# EAGLE design wordclock_frame_led_pcb (EAGLE 9.6.2)
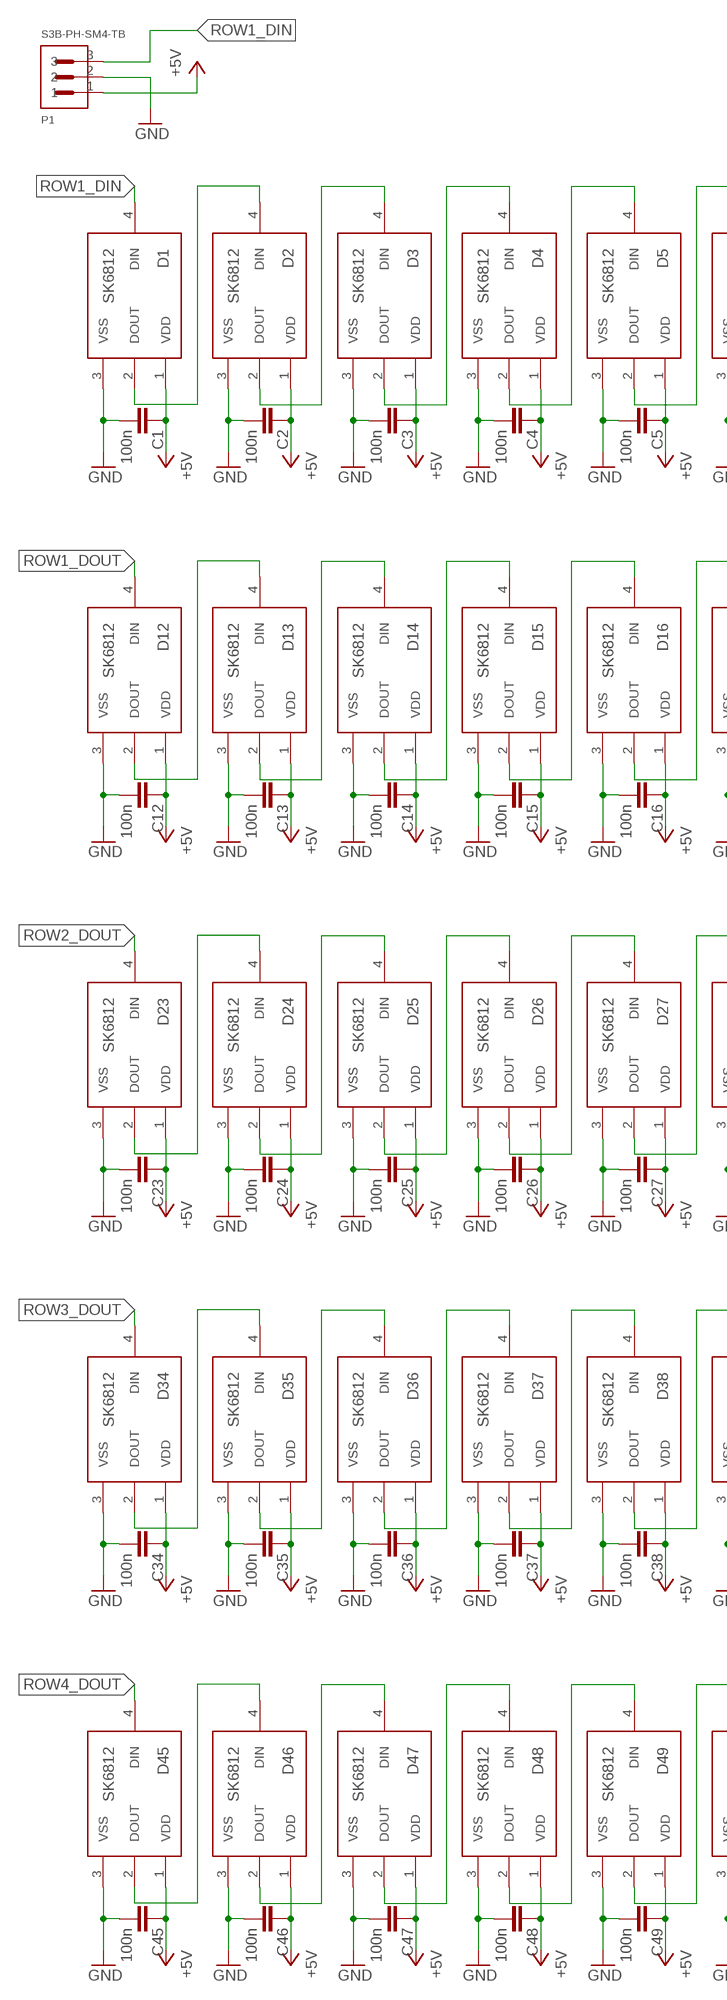
[diagram p0: schematic, sheet 1, part 1 of 2]
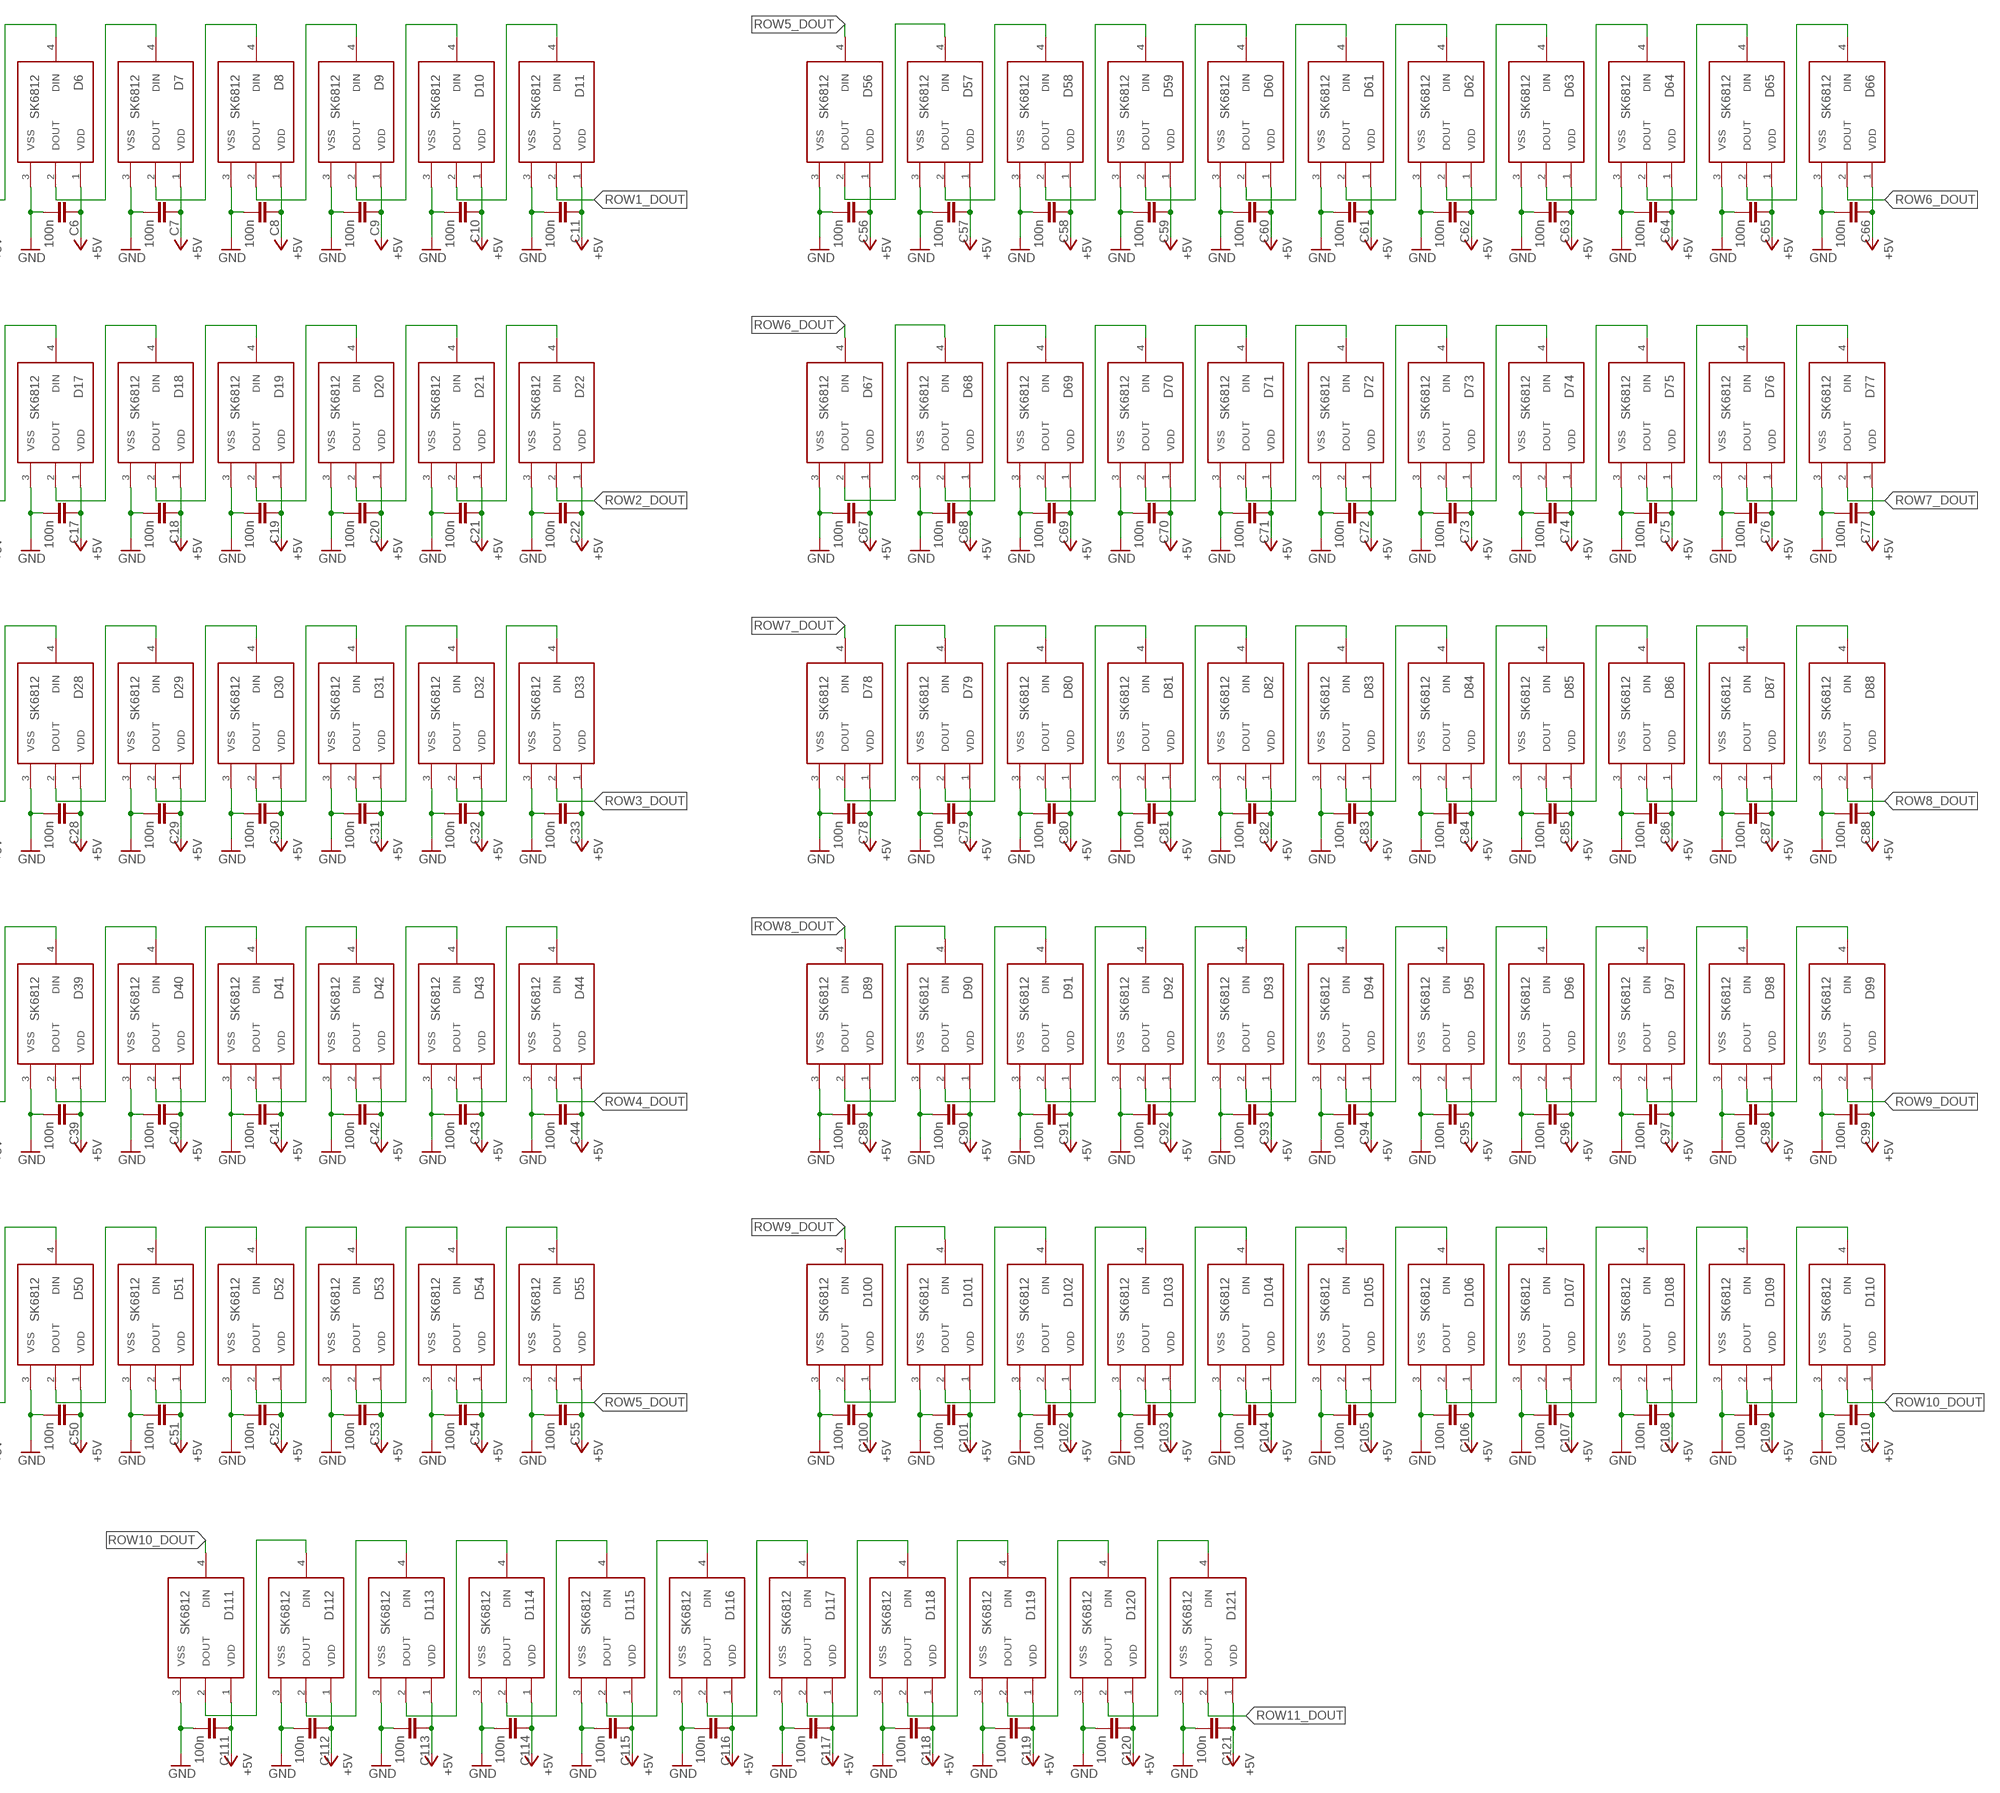
[diagram p1: schematic, sheet 1, part 2 of 2]

## Parts
C1  100n  C-EUC0603  [C0603]
C2  100n  C-EUC0603  [C0603]
C3  100n  C-EUC0603  [C0603]
C4  100n  C-EUC0603  [C0603]
C5  100n  C-EUC0603  [C0603]
C6  100n  C-EUC0603  [C0603]
C7  100n  C-EUC0603  [C0603]
C8  100n  C-EUC0603  [C0603]
C9  100n  C-EUC0603  [C0603]
C10  100n  C-EUC0603  [C0603]
C11  100n  C-EUC0603  [C0603]
C12  100n  C-EUC0603  [C0603]
C13  100n  C-EUC0603  [C0603]
C14  100n  C-EUC0603  [C0603]
C15  100n  C-EUC0603  [C0603]
C16  100n  C-EUC0603  [C0603]
C17  100n  C-EUC0603  [C0603]
C18  100n  C-EUC0603  [C0603]
C19  100n  C-EUC0603  [C0603]
C20  100n  C-EUC0603  [C0603]
C21  100n  C-EUC0603  [C0603]
C22  100n  C-EUC0603  [C0603]
C23  100n  C-EUC0603  [C0603]
C24  100n  C-EUC0603  [C0603]
C25  100n  C-EUC0603  [C0603]
C26  100n  C-EUC0603  [C0603]
C27  100n  C-EUC0603  [C0603]
C28  100n  C-EUC0603  [C0603]
C29  100n  C-EUC0603  [C0603]
C30  100n  C-EUC0603  [C0603]
C31  100n  C-EUC0603  [C0603]
C32  100n  C-EUC0603  [C0603]
C33  100n  C-EUC0603  [C0603]
C34  100n  C-EUC0603  [C0603]
C35  100n  C-EUC0603  [C0603]
C36  100n  C-EUC0603  [C0603]
C37  100n  C-EUC0603  [C0603]
C38  100n  C-EUC0603  [C0603]
C39  100n  C-EUC0603  [C0603]
C40  100n  C-EUC0603  [C0603]
C41  100n  C-EUC0603  [C0603]
C42  100n  C-EUC0603  [C0603]
C43  100n  C-EUC0603  [C0603]
C44  100n  C-EUC0603  [C0603]
C45  100n  C-EUC0603  [C0603]
C46  100n  C-EUC0603  [C0603]
C47  100n  C-EUC0603  [C0603]
C48  100n  C-EUC0603  [C0603]
C49  100n  C-EUC0603  [C0603]
C50  100n  C-EUC0603  [C0603]
C51  100n  C-EUC0603  [C0603]
C52  100n  C-EUC0603  [C0603]
C53  100n  C-EUC0603  [C0603]
C54  100n  C-EUC0603  [C0603]
C55  100n  C-EUC0603  [C0603]
C56  100n  C-EUC0603  [C0603]
C57  100n  C-EUC0603  [C0603]
C58  100n  C-EUC0603  [C0603]
C59  100n  C-EUC0603  [C0603]
C60  100n  C-EUC0603  [C0603]
C61  100n  C-EUC0603  [C0603]
C62  100n  C-EUC0603  [C0603]
C63  100n  C-EUC0603  [C0603]
C64  100n  C-EUC0603  [C0603]
C65  100n  C-EUC0603  [C0603]
C66  100n  C-EUC0603  [C0603]
C67  100n  C-EUC0603  [C0603]
C68  100n  C-EUC0603  [C0603]
C69  100n  C-EUC0603  [C0603]
C70  100n  C-EUC0603  [C0603]
C71  100n  C-EUC0603  [C0603]
C72  100n  C-EUC0603  [C0603]
C73  100n  C-EUC0603  [C0603]
C74  100n  C-EUC0603  [C0603]
C75  100n  C-EUC0603  [C0603]
C76  100n  C-EUC0603  [C0603]
C77  100n  C-EUC0603  [C0603]
C78  100n  C-EUC0603  [C0603]
C79  100n  C-EUC0603  [C0603]
C80  100n  C-EUC0603  [C0603]
C81  100n  C-EUC0603  [C0603]
C82  100n  C-EUC0603  [C0603]
C83  100n  C-EUC0603  [C0603]
C84  100n  C-EUC0603  [C0603]
C85  100n  C-EUC0603  [C0603]
C86  100n  C-EUC0603  [C0603]
C87  100n  C-EUC0603  [C0603]
C88  100n  C-EUC0603  [C0603]
C89  100n  C-EUC0603  [C0603]
C90  100n  C-EUC0603  [C0603]
C91  100n  C-EUC0603  [C0603]
C92  100n  C-EUC0603  [C0603]
C93  100n  C-EUC0603  [C0603]
C94  100n  C-EUC0603  [C0603]
C95  100n  C-EUC0603  [C0603]
C96  100n  C-EUC0603  [C0603]
C97  100n  C-EUC0603  [C0603]
C98  100n  C-EUC0603  [C0603]
C99  100n  C-EUC0603  [C0603]
C100  100n  C-EUC0603  [C0603]
C101  100n  C-EUC0603  [C0603]
C102  100n  C-EUC0603  [C0603]
C103  100n  C-EUC0603  [C0603]
C104  100n  C-EUC0603  [C0603]
C105  100n  C-EUC0603  [C0603]
C106  100n  C-EUC0603  [C0603]
C107  100n  C-EUC0603  [C0603]
C108  100n  C-EUC0603  [C0603]
C109  100n  C-EUC0603  [C0603]
C110  100n  C-EUC0603  [C0603]
C111  100n  C-EUC0603  [C0603]
C112  100n  C-EUC0603  [C0603]
C113  100n  C-EUC0603  [C0603]
C114  100n  C-EUC0603  [C0603]
C115  100n  C-EUC0603  [C0603]
C116  100n  C-EUC0603  [C0603]
C117  100n  C-EUC0603  [C0603]
C118  100n  C-EUC0603  [C0603]
C119  100n  C-EUC0603  [C0603]
C120  100n  C-EUC0603  [C0603]
C121  100n  C-EUC0603  [C0603]
D1  SK6812  [LED_SK6812]
D2  SK6812  [LED_SK6812]
D3  SK6812  [LED_SK6812]
D4  SK6812  [LED_SK6812]
D5  SK6812  [LED_SK6812]
D6  SK6812  [LED_SK6812]
D7  SK6812  [LED_SK6812]
D8  SK6812  [LED_SK6812]
D9  SK6812  [LED_SK6812]
D10  SK6812  [LED_SK6812]
D11  SK6812  [LED_SK6812]
D12  SK6812  [LED_SK6812]
D13  SK6812  [LED_SK6812]
D14  SK6812  [LED_SK6812]
D15  SK6812  [LED_SK6812]
D16  SK6812  [LED_SK6812]
D17  SK6812  [LED_SK6812]
D18  SK6812  [LED_SK6812]
D19  SK6812  [LED_SK6812]
D20  SK6812  [LED_SK6812]
D21  SK6812  [LED_SK6812]
D22  SK6812  [LED_SK6812]
D23  SK6812  [LED_SK6812]
D24  SK6812  [LED_SK6812]
D25  SK6812  [LED_SK6812]
D26  SK6812  [LED_SK6812]
D27  SK6812  [LED_SK6812]
D28  SK6812  [LED_SK6812]
D29  SK6812  [LED_SK6812]
D30  SK6812  [LED_SK6812]
D31  SK6812  [LED_SK6812]
D32  SK6812  [LED_SK6812]
D33  SK6812  [LED_SK6812]
D34  SK6812  [LED_SK6812]
D35  SK6812  [LED_SK6812]
D36  SK6812  [LED_SK6812]
D37  SK6812  [LED_SK6812]
D38  SK6812  [LED_SK6812]
D39  SK6812  [LED_SK6812]
D40  SK6812  [LED_SK6812]
D41  SK6812  [LED_SK6812]
D42  SK6812  [LED_SK6812]
D43  SK6812  [LED_SK6812]
D44  SK6812  [LED_SK6812]
D45  SK6812  [LED_SK6812]
D46  SK6812  [LED_SK6812]
D47  SK6812  [LED_SK6812]
D48  SK6812  [LED_SK6812]
D49  SK6812  [LED_SK6812]
D50  SK6812  [LED_SK6812]
D51  SK6812  [LED_SK6812]
D52  SK6812  [LED_SK6812]
D53  SK6812  [LED_SK6812]
D54  SK6812  [LED_SK6812]
D55  SK6812  [LED_SK6812]
D56  SK6812  [LED_SK6812]
D57  SK6812  [LED_SK6812]
D58  SK6812  [LED_SK6812]
D59  SK6812  [LED_SK6812]
D60  SK6812  [LED_SK6812]
D61  SK6812  [LED_SK6812]
D62  SK6812  [LED_SK6812]
D63  SK6812  [LED_SK6812]
D64  SK6812  [LED_SK6812]
D65  SK6812  [LED_SK6812]
D66  SK6812  [LED_SK6812]
D67  SK6812  [LED_SK6812]
D68  SK6812  [LED_SK6812]
D69  SK6812  [LED_SK6812]
D70  SK6812  [LED_SK6812]
D71  SK6812  [LED_SK6812]
D72  SK6812  [LED_SK6812]
D73  SK6812  [LED_SK6812]
D74  SK6812  [LED_SK6812]
D75  SK6812  [LED_SK6812]
D76  SK6812  [LED_SK6812]
D77  SK6812  [LED_SK6812]
D78  SK6812  [LED_SK6812]
D79  SK6812  [LED_SK6812]
D80  SK6812  [LED_SK6812]
D81  SK6812  [LED_SK6812]
D82  SK6812  [LED_SK6812]
D83  SK6812  [LED_SK6812]
D84  SK6812  [LED_SK6812]
D85  SK6812  [LED_SK6812]
D86  SK6812  [LED_SK6812]
D87  SK6812  [LED_SK6812]
D88  SK6812  [LED_SK6812]
D89  SK6812  [LED_SK6812]
D90  SK6812  [LED_SK6812]
D91  SK6812  [LED_SK6812]
D92  SK6812  [LED_SK6812]
D93  SK6812  [LED_SK6812]
D94  SK6812  [LED_SK6812]
D95  SK6812  [LED_SK6812]
D96  SK6812  [LED_SK6812]
D97  SK6812  [LED_SK6812]
D98  SK6812  [LED_SK6812]
D99  SK6812  [LED_SK6812]
D100  SK6812  [LED_SK6812]
D101  SK6812  [LED_SK6812]
D102  SK6812  [LED_SK6812]
D103  SK6812  [LED_SK6812]
D104  SK6812  [LED_SK6812]
D105  SK6812  [LED_SK6812]
D106  SK6812  [LED_SK6812]
D107  SK6812  [LED_SK6812]
D108  SK6812  [LED_SK6812]
D109  SK6812  [LED_SK6812]
D110  SK6812  [LED_SK6812]
D111  SK6812  [LED_SK6812]
D112  SK6812  [LED_SK6812]
D113  SK6812  [LED_SK6812]
D114  SK6812  [LED_SK6812]
D115  SK6812  [LED_SK6812]
D116  SK6812  [LED_SK6812]
D117  SK6812  [LED_SK6812]
D118  SK6812  [LED_SK6812]
D119  SK6812  [LED_SK6812]
D120  SK6812  [LED_SK6812]
D121  SK6812  [LED_SK6812]
P1  S3B-PH-SM4-TB  [JST_S3B-PH-SM4-TB]

## Nets
GND: C1.2 C2.2 C3.2 C4.2 C5.2 C6.2 C7.2 C8.2 C9.2 C10.2 C11.2 C12.2 C13.2 C14.2 C15.2 C16.2 C17.2 C18.2 C19.2 C20.2 C21.2 C22.2 C23.2 C24.2 C25.2 C26.2 C27.2 C28.2 C29.2 C30.2 C31.2 C32.2 C33.2 C34.2 C35.2 C36.2 C37.2 C38.2 C39.2 C40.2 C41.2 C42.2 C43.2 C44.2 C45.2 C46.2 C47.2 C48.2 C49.2 C50.2 C51.2 C52.2 C53.2 C54.2 C55.2 C56.2 C57.2 C58.2 C59.2 C60.2 C61.2 C62.2 C63.2 C64.2 C65.2 C66.2 C67.2 C68.2 C69.2 C70.2 C71.2 C72.2 C73.2 C74.2 C75.2 C76.2 C77.2 C78.2 C79.2 C80.2 C81.2 C82.2 C83.2 C84.2 C85.2 C86.2 C87.2 C88.2 C89.2 C90.2 C91.2 C92.2 C93.2 C94.2 C95.2 C96.2 C97.2 C98.2 C99.2 C100.2 C101.2 C102.2 C103.2 C104.2 C105.2 C106.2 C107.2 C108.2 C109.2 C110.2 C111.2 C112.2 C113.2 C114.2 C115.2 C116.2 C117.2 C118.2 C119.2 C120.2 C121.2 D1.3(VSS) D2.3(VSS) D3.3(VSS) D4.3(VSS) D5.3(VSS) D6.3(VSS) D7.3(VSS) D8.3(VSS) D9.3(VSS) D10.3(VSS) D11.3(VSS) D12.3(VSS) D13.3(VSS) D14.3(VSS) D15.3(VSS) D16.3(VSS) D17.3(VSS) D18.3(VSS) D19.3(VSS) D20.3(VSS) D21.3(VSS) D22.3(VSS) D23.3(VSS) D24.3(VSS) D25.3(VSS) D26.3(VSS) D27.3(VSS) D28.3(VSS) D29.3(VSS) D30.3(VSS) D31.3(VSS) D32.3(VSS) D33.3(VSS) D34.3(VSS) D35.3(VSS) D36.3(VSS) D37.3(VSS) D38.3(VSS) D39.3(VSS) D40.3(VSS) D41.3(VSS) D42.3(VSS) D43.3(VSS) D44.3(VSS) D45.3(VSS) D46.3(VSS) D47.3(VSS) D48.3(VSS) D49.3(VSS) D50.3(VSS) D51.3(VSS) D52.3(VSS) D53.3(VSS) D54.3(VSS) D55.3(VSS) D56.3(VSS) D57.3(VSS) D58.3(VSS) D59.3(VSS) D60.3(VSS) D61.3(VSS) D62.3(VSS) D63.3(VSS) D64.3(VSS) D65.3(VSS) D66.3(VSS) D67.3(VSS) D68.3(VSS) D69.3(VSS) D70.3(VSS) D71.3(VSS) D72.3(VSS) D73.3(VSS) D74.3(VSS) D75.3(VSS) D76.3(VSS) D77.3(VSS) D78.3(VSS) D79.3(VSS) D80.3(VSS) D81.3(VSS) D82.3(VSS) D83.3(VSS) D84.3(VSS) D85.3(VSS) D86.3(VSS) D87.3(VSS) D88.3(VSS) D89.3(VSS) D90.3(VSS) D91.3(VSS) D92.3(VSS) D93.3(VSS) D94.3(VSS) D95.3(VSS) D96.3(VSS) D97.3(VSS) D98.3(VSS) D99.3(VSS) D100.3(VSS) D101.3(VSS) D102.3(VSS) D103.3(VSS) D104.3(VSS) D105.3(VSS) D106.3(VSS) D107.3(VSS) D108.3(VSS) D109.3(VSS) D110.3(VSS) D111.3(VSS) D112.3(VSS) D113.3(VSS) D114.3(VSS) D115.3(VSS) D116.3(VSS) D117.3(VSS) D118.3(VSS) D119.3(VSS) D120.3(VSS) D121.3(VSS) P1.2
N$1: D1.2(DOUT) D2.4(DIN)
N$2: D2.2(DOUT) D3.4(DIN)
N$3: D3.2(DOUT) D4.4(DIN)
N$4: D4.2(DOUT) D5.4(DIN)
N$5: D5.2(DOUT) D6.4(DIN)
N$6: D6.2(DOUT) D7.4(DIN)
N$7: D7.2(DOUT) D8.4(DIN)
N$8: D8.2(DOUT) D9.4(DIN)
N$9: D9.2(DOUT) D10.4(DIN)
N$10: D10.2(DOUT) D11.4(DIN)
N$11: D12.2(DOUT) D13.4(DIN)
N$12: D13.2(DOUT) D14.4(DIN)
N$13: D14.2(DOUT) D15.4(DIN)
N$14: D15.2(DOUT) D16.4(DIN)
N$15: D16.2(DOUT) D17.4(DIN)
N$16: D17.2(DOUT) D18.4(DIN)
N$17: D18.2(DOUT) D19.4(DIN)
N$18: D19.2(DOUT) D20.4(DIN)
N$19: D20.2(DOUT) D21.4(DIN)
N$20: D21.2(DOUT) D22.4(DIN)
N$21: D23.2(DOUT) D24.4(DIN)
N$22: D24.2(DOUT) D25.4(DIN)
N$23: D25.2(DOUT) D26.4(DIN)
N$24: D26.2(DOUT) D27.4(DIN)
N$25: D27.2(DOUT) D28.4(DIN)
N$26: D28.2(DOUT) D29.4(DIN)
N$27: D29.2(DOUT) D30.4(DIN)
N$28: D30.2(DOUT) D31.4(DIN)
N$29: D31.2(DOUT) D32.4(DIN)
N$30: D32.2(DOUT) D33.4(DIN)
N$31: D34.2(DOUT) D35.4(DIN)
N$32: D35.2(DOUT) D36.4(DIN)
N$33: D36.2(DOUT) D37.4(DIN)
N$34: D37.2(DOUT) D38.4(DIN)
N$35: D38.2(DOUT) D39.4(DIN)
N$36: D39.2(DOUT) D40.4(DIN)
N$37: D40.2(DOUT) D41.4(DIN)
N$38: D41.2(DOUT) D42.4(DIN)
N$39: D42.2(DOUT) D43.4(DIN)
N$40: D43.2(DOUT) D44.4(DIN)
N$41: D45.2(DOUT) D46.4(DIN)
N$42: D46.2(DOUT) D47.4(DIN)
N$43: D47.2(DOUT) D48.4(DIN)
N$44: D48.2(DOUT) D49.4(DIN)
N$45: D49.2(DOUT) D50.4(DIN)
N$46: D50.2(DOUT) D51.4(DIN)
N$47: D51.2(DOUT) D52.4(DIN)
N$48: D52.2(DOUT) D53.4(DIN)
N$49: D53.2(DOUT) D54.4(DIN)
N$50: D54.2(DOUT) D55.4(DIN)
N$51: D56.2(DOUT) D57.4(DIN)
N$52: D57.2(DOUT) D58.4(DIN)
N$53: D58.2(DOUT) D59.4(DIN)
N$54: D59.2(DOUT) D60.4(DIN)
N$55: D60.2(DOUT) D61.4(DIN)
N$56: D61.2(DOUT) D62.4(DIN)
N$57: D62.2(DOUT) D63.4(DIN)
N$58: D63.2(DOUT) D64.4(DIN)
N$59: D64.2(DOUT) D65.4(DIN)
N$60: D65.2(DOUT) D66.4(DIN)
N$61: D67.2(DOUT) D68.4(DIN)
N$62: D68.2(DOUT) D69.4(DIN)
N$63: D69.2(DOUT) D70.4(DIN)
N$64: D70.2(DOUT) D71.4(DIN)
N$65: D71.2(DOUT) D72.4(DIN)
N$66: D72.2(DOUT) D73.4(DIN)
N$67: D73.2(DOUT) D74.4(DIN)
N$68: D74.2(DOUT) D75.4(DIN)
N$69: D75.2(DOUT) D76.4(DIN)
N$70: D76.2(DOUT) D77.4(DIN)
N$71: D78.2(DOUT) D79.4(DIN)
N$72: D79.2(DOUT) D80.4(DIN)
N$73: D80.2(DOUT) D81.4(DIN)
N$74: D81.2(DOUT) D82.4(DIN)
N$75: D82.2(DOUT) D83.4(DIN)
N$76: D83.2(DOUT) D84.4(DIN)
N$77: D84.2(DOUT) D85.4(DIN)
N$78: D85.2(DOUT) D86.4(DIN)
N$79: D86.2(DOUT) D87.4(DIN)
N$80: D87.2(DOUT) D88.4(DIN)
N$81: D89.2(DOUT) D90.4(DIN)
N$82: D90.2(DOUT) D91.4(DIN)
N$83: D91.2(DOUT) D92.4(DIN)
N$84: D92.2(DOUT) D93.4(DIN)
N$85: D93.2(DOUT) D94.4(DIN)
N$86: D94.2(DOUT) D95.4(DIN)
N$87: D95.2(DOUT) D96.4(DIN)
N$88: D96.2(DOUT) D97.4(DIN)
N$89: D97.2(DOUT) D98.4(DIN)
N$90: D98.2(DOUT) D99.4(DIN)
N$91: D100.2(DOUT) D101.4(DIN)
N$92: D101.2(DOUT) D102.4(DIN)
N$93: D102.2(DOUT) D103.4(DIN)
N$94: D103.2(DOUT) D104.4(DIN)
N$95: D104.2(DOUT) D105.4(DIN)
N$96: D105.2(DOUT) D106.4(DIN)
N$97: D106.2(DOUT) D107.4(DIN)
N$98: D107.2(DOUT) D108.4(DIN)
N$99: D108.2(DOUT) D109.4(DIN)
N$100: D109.2(DOUT) D110.4(DIN)
N$101: D111.2(DOUT) D112.4(DIN)
N$102: D112.2(DOUT) D113.4(DIN)
N$103: D113.2(DOUT) D114.4(DIN)
N$104: D114.2(DOUT) D115.4(DIN)
N$105: D115.2(DOUT) D116.4(DIN)
N$106: D116.2(DOUT) D117.4(DIN)
N$107: D117.2(DOUT) D118.4(DIN)
N$108: D118.2(DOUT) D119.4(DIN)
N$109: D119.2(DOUT) D120.4(DIN)
N$110: D120.2(DOUT) D121.4(DIN)
ROW1_DIN: D1.4(DIN) P1.3
ROW1_DOUT: D11.2(DOUT) D12.4(DIN)
ROW2_DOUT: D22.2(DOUT) D23.4(DIN)
ROW3_DOUT: D33.2(DOUT) D34.4(DIN)
ROW4_DOUT: D44.2(DOUT) D45.4(DIN)
ROW5_DOUT: D55.2(DOUT) D56.4(DIN)
ROW6_DOUT: D66.2(DOUT) D67.4(DIN)
ROW7_DOUT: D77.2(DOUT) D78.4(DIN)
ROW8_DOUT: D88.2(DOUT) D89.4(DIN)
ROW9_DOUT: D99.2(DOUT) D100.4(DIN)
ROW10_DOUT: D110.2(DOUT) D111.4(DIN)
ROW11_DOUT: D121.2(DOUT)
VCC: C1.1 C2.1 C3.1 C4.1 C5.1 C6.1 C7.1 C8.1 C9.1 C10.1 C11.1 C12.1 C13.1 C14.1 C15.1 C16.1 C17.1 C18.1 C19.1 C20.1 C21.1 C22.1 C23.1 C24.1 C25.1 C26.1 C27.1 C28.1 C29.1 C30.1 C31.1 C32.1 C33.1 C34.1 C35.1 C36.1 C37.1 C38.1 C39.1 C40.1 C41.1 C42.1 C43.1 C44.1 C45.1 C46.1 C47.1 C48.1 C49.1 C50.1 C51.1 C52.1 C53.1 C54.1 C55.1 C56.1 C57.1 C58.1 C59.1 C60.1 C61.1 C62.1 C63.1 C64.1 C65.1 C66.1 C67.1 C68.1 C69.1 C70.1 C71.1 C72.1 C73.1 C74.1 C75.1 C76.1 C77.1 C78.1 C79.1 C80.1 C81.1 C82.1 C83.1 C84.1 C85.1 C86.1 C87.1 C88.1 C89.1 C90.1 C91.1 C92.1 C93.1 C94.1 C95.1 C96.1 C97.1 C98.1 C99.1 C100.1 C101.1 C102.1 C103.1 C104.1 C105.1 C106.1 C107.1 C108.1 C109.1 C110.1 C111.1 C112.1 C113.1 C114.1 C115.1 C116.1 C117.1 C118.1 C119.1 C120.1 C121.1 D1.1(VDD) D2.1(VDD) D3.1(VDD) D4.1(VDD) D5.1(VDD) D6.1(VDD) D7.1(VDD) D8.1(VDD) D9.1(VDD) D10.1(VDD) D11.1(VDD) D12.1(VDD) D13.1(VDD) D14.1(VDD) D15.1(VDD) D16.1(VDD) D17.1(VDD) D18.1(VDD) D19.1(VDD) D20.1(VDD) D21.1(VDD) D22.1(VDD) D23.1(VDD) D24.1(VDD) D25.1(VDD) D26.1(VDD) D27.1(VDD) D28.1(VDD) D29.1(VDD) D30.1(VDD) D31.1(VDD) D32.1(VDD) D33.1(VDD) D34.1(VDD) D35.1(VDD) D36.1(VDD) D37.1(VDD) D38.1(VDD) D39.1(VDD) D40.1(VDD) D41.1(VDD) D42.1(VDD) D43.1(VDD) D44.1(VDD) D45.1(VDD) D46.1(VDD) D47.1(VDD) D48.1(VDD) D49.1(VDD) D50.1(VDD) D51.1(VDD) D52.1(VDD) D53.1(VDD) D54.1(VDD) D55.1(VDD) D56.1(VDD) D57.1(VDD) D58.1(VDD) D59.1(VDD) D60.1(VDD) D61.1(VDD) D62.1(VDD) D63.1(VDD) D64.1(VDD) D65.1(VDD) D66.1(VDD) D67.1(VDD) D68.1(VDD) D69.1(VDD) D70.1(VDD) D71.1(VDD) D72.1(VDD) D73.1(VDD) D74.1(VDD) D75.1(VDD) D76.1(VDD) D77.1(VDD) D78.1(VDD) D79.1(VDD) D80.1(VDD) D81.1(VDD) D82.1(VDD) D83.1(VDD) D84.1(VDD) D85.1(VDD) D86.1(VDD) D87.1(VDD) D88.1(VDD) D89.1(VDD) D90.1(VDD) D91.1(VDD) D92.1(VDD) D93.1(VDD) D94.1(VDD) D95.1(VDD) D96.1(VDD) D97.1(VDD) D98.1(VDD) D99.1(VDD) D100.1(VDD) D101.1(VDD) D102.1(VDD) D103.1(VDD) D104.1(VDD) D105.1(VDD) D106.1(VDD) D107.1(VDD) D108.1(VDD) D109.1(VDD) D110.1(VDD) D111.1(VDD) D112.1(VDD) D113.1(VDD) D114.1(VDD) D115.1(VDD) D116.1(VDD) D117.1(VDD) D118.1(VDD) D119.1(VDD) D120.1(VDD) D121.1(VDD) P1.1 ; supply symbol labelled +5V

## Library data of the parts
C1-C121 = rcl:C-EU: CAPACITOR, European symbol; SPICEPREFIX: C
D1-D121 = led:SK6812: SMD 5050 Full color RGB LED data transmission frequency up to 800Kbps, with 30 fps refresh rate, 5.00x5.00 mm; AVAILABILITY: Not in stock; DESCRIPTION: SMD 5050 Full color RGB LED data transmission frequency up to 800Kbps, with 30 fps refresh rate, 5.00x5.00 mm; MF: Shenzhen LED Color Optoelectronic Inc.; MP: SK6812; PACKAGE: SMD-4 Shenzhen LED Color Optoelectronic Inc.; PRICE: None
P1 = S3B-PH-SM4-TB:S3B-PH-SM4-TB: CONN HEADER PH SIDE 3POS 2MM SMD Check availability <https://pricing.snapeda.com/parts/S3B-PH-SM4-TB/JST/view-part?ref=eda>; AVAILABILITY: In Stock; DESCRIPTION: Connector Header Surface Mount, Right Angle 3 position 0.079 (2.00mm); MF: JST; MP: S3B-PH-SM4-TB; PACKAGE: None; PRICE: None; PURCHASE-URL: https://pricing.snapeda.com/search/part/S3B-PH-SM4-TB/?ref=eda

## Board
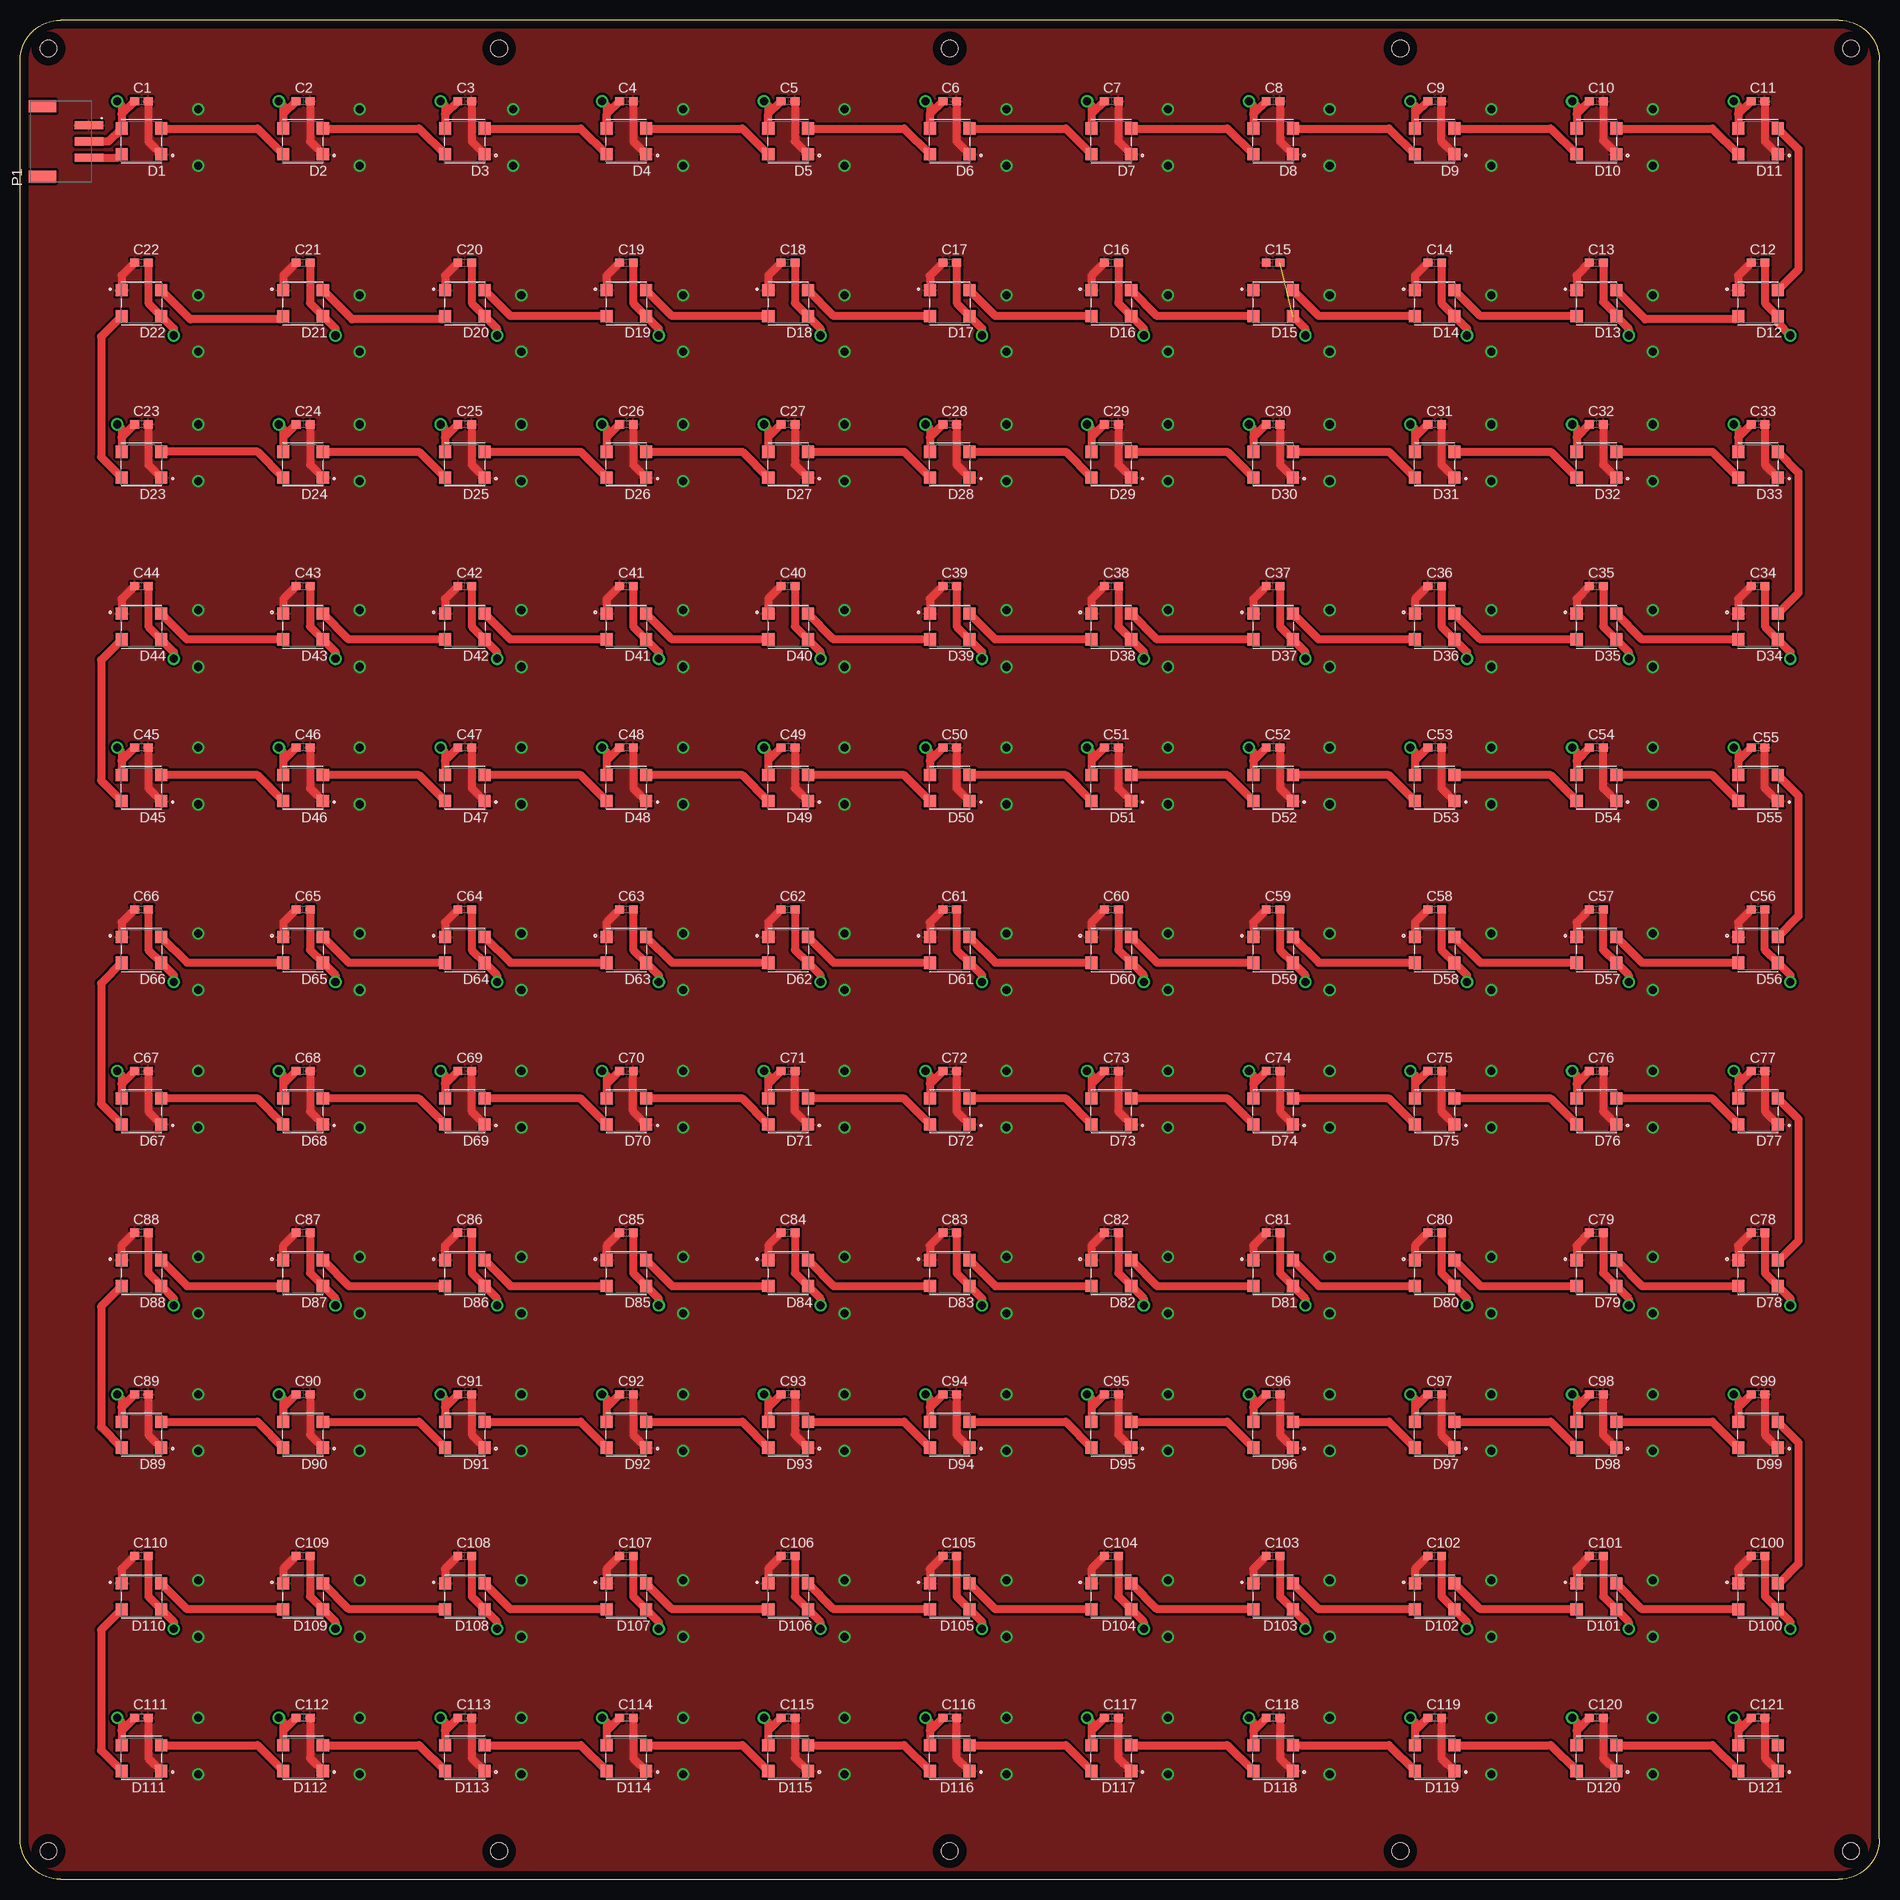
[diagram p2: board, top side]
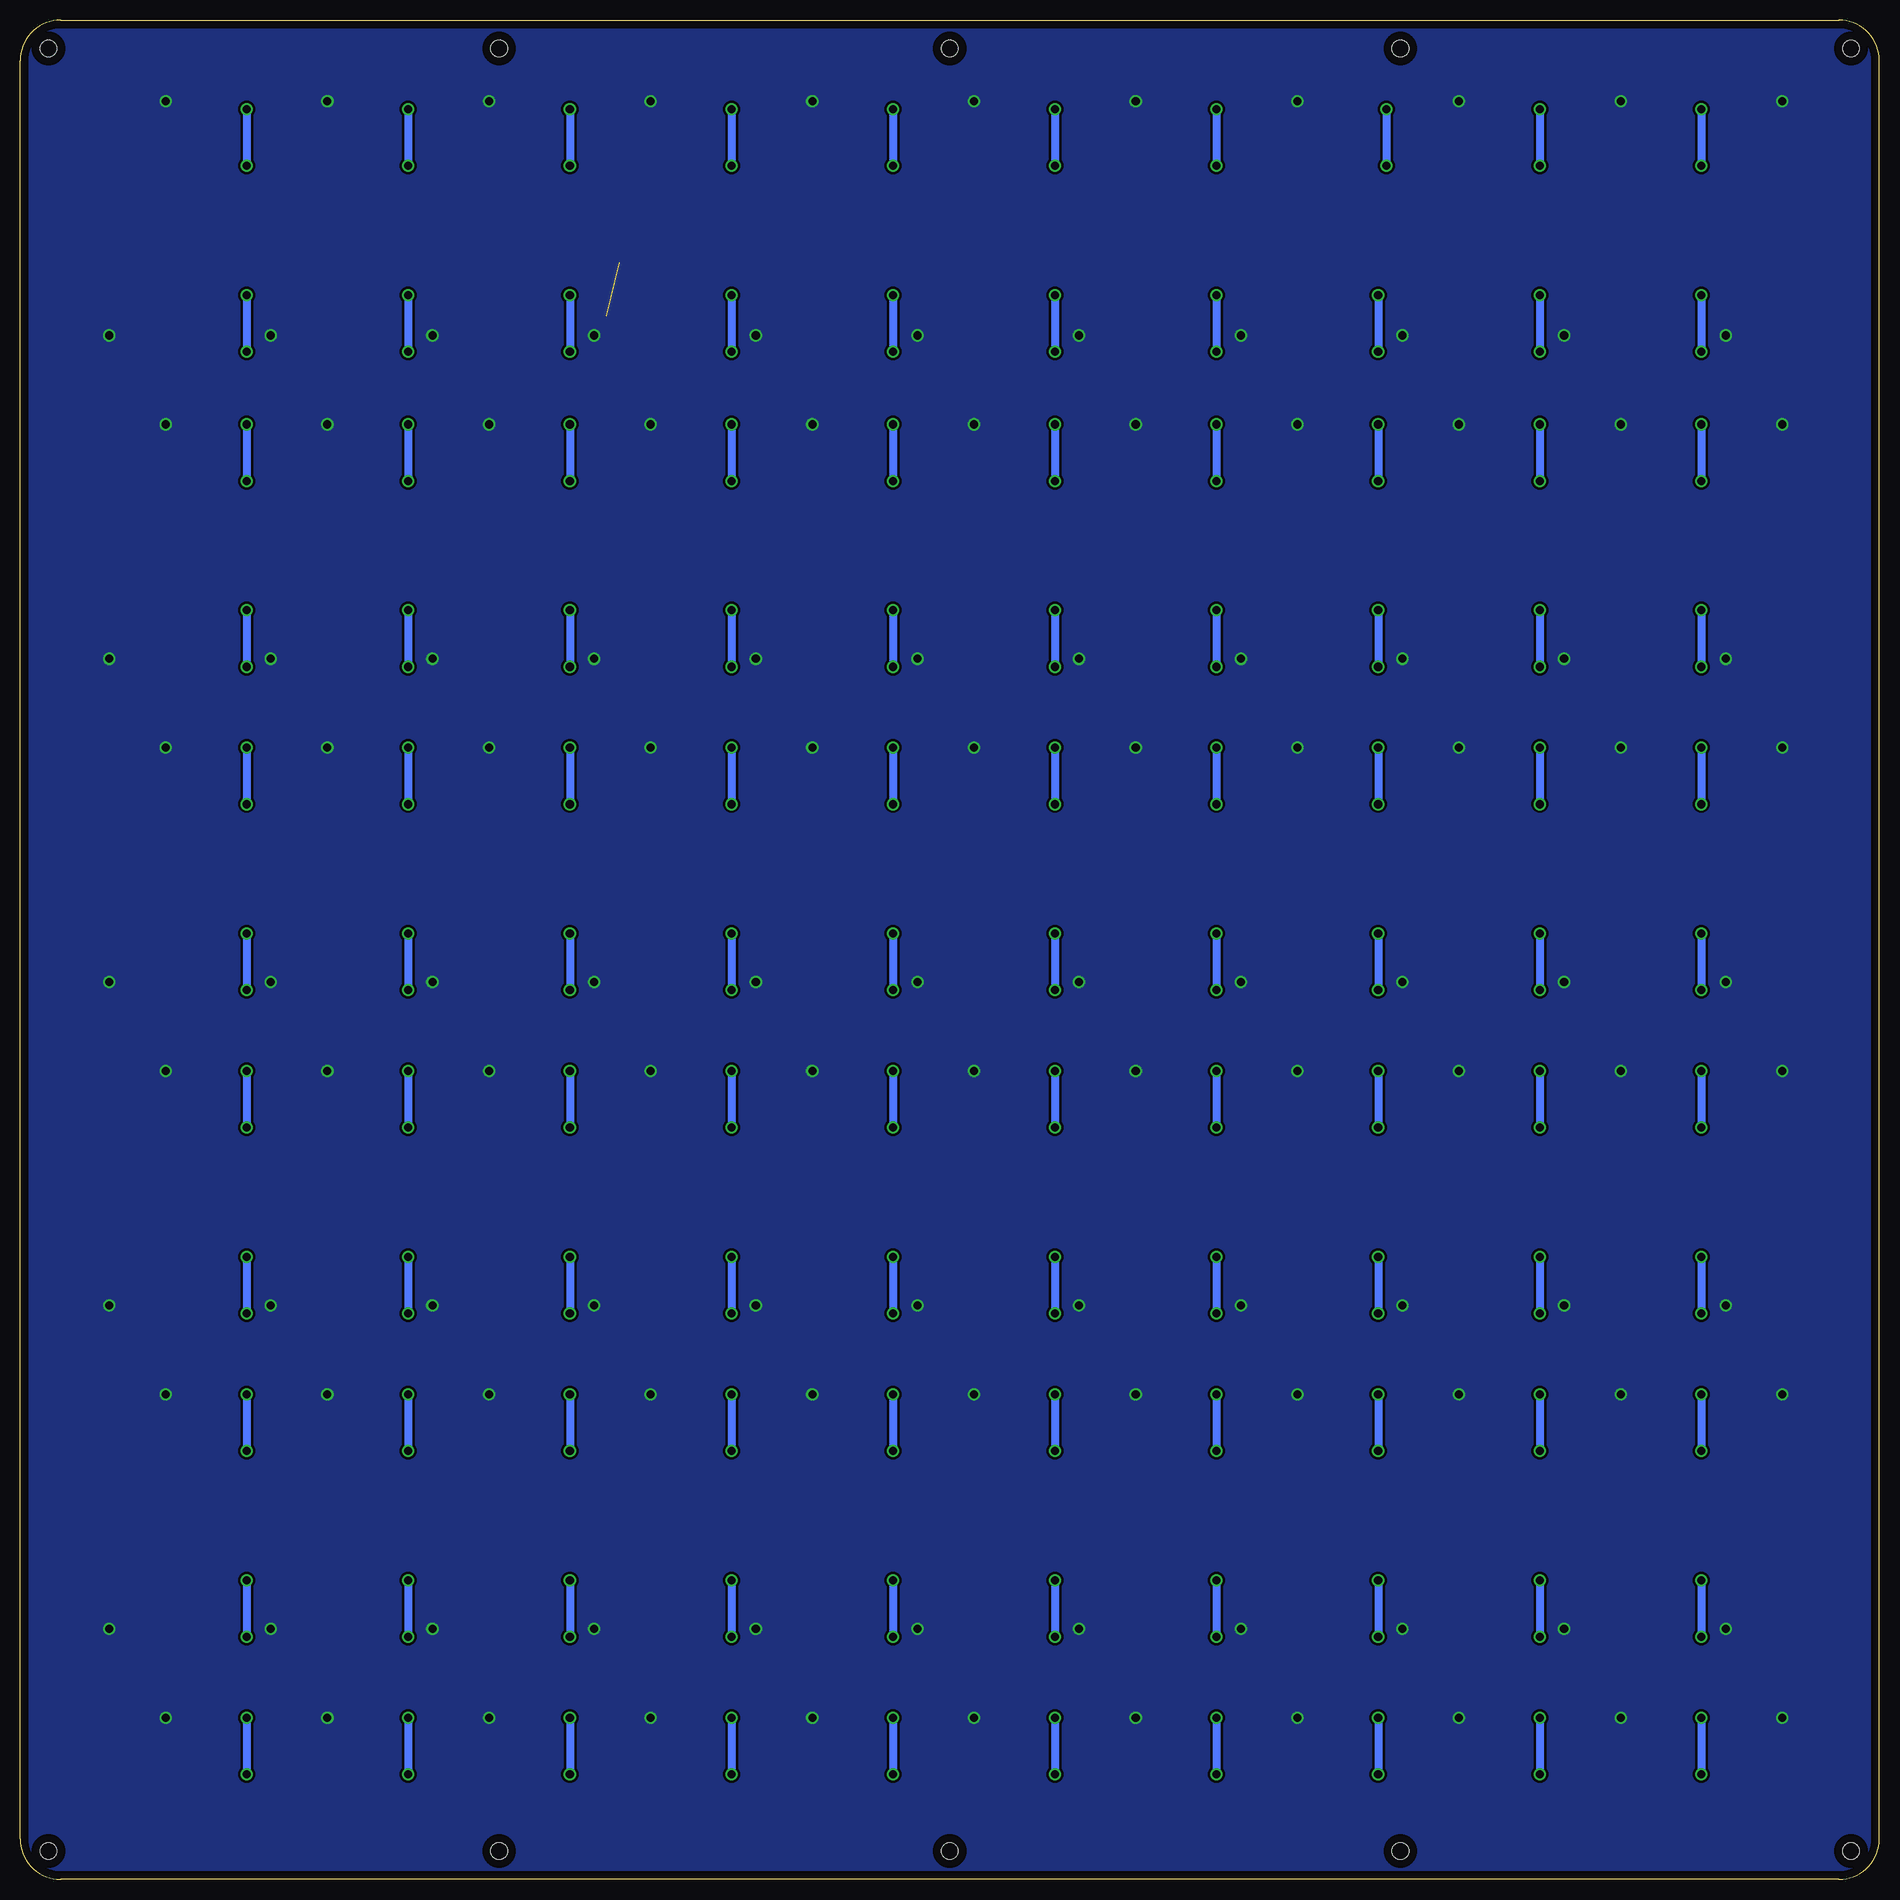
[diagram p3: board, bottom side, seen from below]

Size 230 x 230 mm. Coordinates in mm from the lower left corner, seen from the top.
Outline: 5,0 225,0 arc90 230,5 230,225 arc90 225,230 5,230 arc90 0,225 0,5 arc90 5,0
Copper layers (1*16): Top 0.035mm / dielectric 1.5mm / Bottom 0.035mm
Design rules "default *": minimum track width 6mil, minimum drill 0.35mm, track to track 12mil, track to pad 12mil, pad to pad 12mil, via to via 12mil, smd to smd 12mil, copper to edge 40mil, drill to drill 6mil, minimum pad ring 10mil, minimum via ring 8mil, stop-mask expansion 4mil, vias tented up to drill 40mil, thermal gap 10mil
Holes 2.1 mm at 3.5,3.5 3.5,226.5 226.5,226.5 226.5,3.5 59.25,3.5 115,3.5 170.75,3.5 59.25,226.5 170.75,226.5 115,226.5

### Footprints (pad centres in the part's own frame; a part is rotated, then mirrored left to right if it is on the bottom)
C0603 = smd 1.1 x 1: 1 -0.85,0; 2 0.85,0
LED_SK6812 = smd 1.5 x 1.5: 1 -2.45,1.6; 2 -2.45,-1.6; 3 2.45,-1.6; 4 2.45,1.6
JST_S3B-PH-SM4-TB = smd 1 x 3.5: 1 2,0; 2 0,0; 3 -2,0 | smd 1.5 x 3.4: P1 4.35,5.75; P2 -4.35,5.75

### Placement (x,y rotation side)
C1  15,220 180 top
C2  35,220 180 top
C3  55,220 180 top
C4  75,220 180 top
C5  95,220 180 top
C6  115,220 180 top
C7  135,220 180 top
C8  155,220 180 top
C9  175,220 180 top
C10  195,220 180 top
C11  215,220 180 top
C12  215,200 0 top
C13  195,200 0 top
C14  175,200 0 top
C15  155,200 0 top
C16  135,200 0 top
C17  115,200 0 top
C18  95,200 0 top
C19  75,200 0 top
C20  55,200 0 top
C21  35,200 0 top
C22  15,200 0 top
C23  15,180 180 top
C24  35,180 180 top
C25  55,180 180 top
C26  75,180 180 top
C27  95,180 180 top
C28  115,180 180 top
C29  135,180 180 top
C30  155,180 180 top
C31  175,180 180 top
C32  195,180 180 top
C33  215,180 180 top
C34  215,160 0 top
C35  195,160 0 top
C36  175,160 0 top
C37  155,160 0 top
C38  135,160 0 top
C39  115,160 0 top
C40  95,160 0 top
C41  75,160 0 top
C42  55,160 0 top
C43  35,160 0 top
C44  15,160 0 top
C45  15,140 180 top
C46  35,140 180 top
C47  55,140 180 top
C48  75,140 180 top
C49  95,140 180 top
C50  115,140 180 top
C51  135,140 180 top
C52  155,140 180 top
C53  175,140 180 top
C54  195,140 180 top
C55  215,140 180 top
C56  215,120 0 top
C57  195,120 0 top
C58  175,120 0 top
C59  155,120 0 top
C60  135,120 0 top
C61  115,120 0 top
C62  95,120 0 top
C63  75,120 0 top
C64  55,120 0 top
C65  35,120 0 top
C66  15,120 0 top
C67  15,100 180 top
C68  35,100 180 top
C69  55,100 180 top
C70  75,100 180 top
C71  95,100 180 top
C72  115,100 180 top
C73  135,100 180 top
C74  155,100 180 top
C75  175,100 180 top
C76  195,100 180 top
C77  215,100 180 top
C78  215,80 0 top
C79  195,80 0 top
C80  175,80 0 top
C81  155,80 0 top
C82  135,80 0 top
C83  115,80 0 top
C84  95,80 0 top
C85  75,80 0 top
C86  55,80 0 top
C87  35,80 0 top
C88  15,80 0 top
C89  15,60 180 top
C90  35,60 180 top
C91  55,60 180 top
C92  75,60 180 top
C93  95,60 180 top
C94  115,60 180 top
C95  135,60 180 top
C96  155,60 180 top
C97  175,60 180 top
C98  195,60 180 top
C99  215,60 180 top
C100  215,40 0 top
C101  195,40 0 top
C102  175,40 0 top
C103  155,40 0 top
C104  135,40 0 top
C105  115,40 0 top
C106  95,40 0 top
C107  75,40 0 top
C108  55,40 0 top
C109  35,40 0 top
C110  15,40 0 top
C111  15,20 180 top
C112  35,20 180 top
C113  55,20 180 top
C114  75,20 180 top
C115  95,20 180 top
C116  115,20 180 top
C117  135,20 180 top
C118  155,20 180 top
C119  175,20 180 top
C120  195,20 180 top
C121  215,20 180 top
D1  15,215 180 top
D2  35,215 180 top
D3  55,215 180 top
D4  75,215 180 top
D5  95,215 180 top
D6  115,215 180 top
D7  135,215 180 top
D8  155,215 180 top
D9  175,215 180 top
D10  195,215 180 top
D11  215,215 180 top
D12  215,195 0 top
D13  195,195 0 top
D14  175,195 0 top
D15  155,195 0 top
D16  135,195 0 top
D17  115,195 0 top
D18  95,195 0 top
D19  75,195 0 top
D20  55,195 0 top
D21  35,195 0 top
D22  15,195 0 top
D23  15,175 180 top
D24  35,175 180 top
D25  55,175 180 top
D26  75,175 180 top
D27  95,175 180 top
D28  115,175 180 top
D29  135,175 180 top
D30  155,175 180 top
D31  175,175 180 top
D32  195,175 180 top
D33  215,175 180 top
D34  215,155 0 top
D35  195,155 0 top
D36  175,155 0 top
D37  155,155 0 top
D38  135,155 0 top
D39  115,155 0 top
D40  95,155 0 top
D41  75,155 0 top
D42  55,155 0 top
D43  35,155 0 top
D44  15,155 0 top
D45  15,135 180 top
D46  35,135 180 top
D47  55,135 180 top
D48  75,135 180 top
D49  95,135 180 top
D50  115,135 180 top
D51  135,135 180 top
D52  155,135 180 top
D53  175,135 180 top
D54  195,135 180 top
D55  215,135 180 top
D56  215,115 0 top
D57  195,115 0 top
D58  175,115 0 top
D59  155,115 0 top
D60  135,115 0 top
D61  115,115 0 top
D62  95,115 0 top
D63  75,115 0 top
D64  55,115 0 top
D65  35,115 0 top
D66  15,115 0 top
D67  15,95 180 top
D68  35,95 180 top
D69  55,95 180 top
D70  75,95 180 top
D71  95,95 180 top
D72  115,95 180 top
D73  135,95 180 top
D74  155,95 180 top
D75  175,95 180 top
D76  195,95 180 top
D77  215,95 180 top
D78  215,75 0 top
D79  195,75 0 top
D80  175,75 0 top
D81  155,75 0 top
D82  135,75 0 top
D83  115,75 0 top
D84  95,75 0 top
D85  75,75 0 top
D86  55,75 0 top
D87  35,75 0 top
D88  15,75 0 top
D89  15,55 180 top
D90  35,55 180 top
D91  55,55 180 top
D92  75,55 180 top
D93  95,55 180 top
D94  115,55 180 top
D95  135,55 180 top
D96  155,55 180 top
D97  175,55 180 top
D98  195,55 180 top
D99  215,55 180 top
D100  215,35 0 top
D101  195,35 0 top
D102  175,35 0 top
D103  155,35 0 top
D104  135,35 0 top
D105  115,35 0 top
D106  95,35 0 top
D107  75,35 0 top
D108  55,35 0 top
D109  35,35 0 top
D110  15,35 0 top
D111  15,15 180 top
D112  35,15 180 top
D113  55,15 180 top
D114  75,15 180 top
D115  95,15 180 top
D116  115,15 180 top
D117  135,15 180 top
D118  155,15 180 top
D119  175,15 180 top
D120  195,15 180 top
D121  215,15 180 top
P1  8.5,215 90 top

### Tracks (layer width: path | path; a pad name or v marks a point on that pad's centre or on a via)
GND  (via drill 1)  (1 unrouted)
  Top 1: C1.2 12.55,218.4 D1.3 | C2.2 32.55,218.4 D2.3 | C3.2 52.55,218.4 D3.3 52.55,219.45 v52,220 | 32.55,217.45 D2.3 | 72.55,217.45 D4.3 | D5.3 92.55,217.45 | D5.3 92.55,218.4 C5.2 | D4.3 72.55,218.4 C4.2 | C6.2 112.55,218.4 D6.3 112.55,219.45 v112,220 | v132,220 132.55,219.45 D7.3 132.55,218.4 C7.2 | C8.2 152.55,218.4 D8.3 | 152.55,218.45 D8.3 | C9.2 172.55,218.4 D9.3 | 172.55,217.45 D9.3 | C16.2 135.85,195 D16.3 139,191.85 v139,191 | D15.3 159,191.85 v159,191 | v179,191 179,191.85 D14.3 175.85,195 C14.2 | v219,191 217.45,192.55 D12.3 215.85,195 C12.2 | C11.2 212.55,218.4 D11.3 212.55,219.45 v212,220 | C10.2 192.55,218.4 D10.3 192.55,219.45 v192,220 | C17.2 115.85,195 D17.3 119,191.85 v119,191 | v99,191 99,191.85 D18.3 95.85,195 C18.2 | C22.2 15.85,195 D22.3 19,191.85 v19,191 | v39,191 39,191.85 D21.3 35.85,195 C21.2 | v59,191 59,191.85 D20.3 55.85,195 C20.2 | v79,191 79,191.85 D19.3 75.85,195 C19.2 | v199,191 199,191.85 D13.3 197.45,193.55 195.85,195.15 C13.2 | C23.2 12.55,178.4 D23.3 12.55,179.45 v12,180 | v172,220 172.55,219.45 D9.3 | v152,220 152.55,219.45 D8.3 | v12,220 12.55,219.45 D1.3 | v32,220 32.55,219.45 D2.3 | v72,220 72.55,219.45 D4.3 | v92,220 92.55,219.45 D5.3 | C44.2 15.85,155 D44.3 19,151.85 v19,151 | v39,151 39,151.85 D43.3 35.85,155 C43.2 | C42.2 55.85,155 D42.3 59,151.85 v59,151 | C24.2 32.55,178.4 D24.3 32.55,179.45 v32,180 | v52,180 52.55,179.45 D25.3 52.55,178.4 C25.2 | C26.2 72.55,178.4 D26.3 72.55,179.45 v72,180 | C27.2 92.55,178.4 D27.3 92.55,179.45 v92,180 | C28.2 112.55,178.4 D28.3 112.55,179.45 v112,180 | C29.2 132.55,178.4 D29.3 132.55,179.45 v132,180 | C30.2 152.55,178.4 D30.3 152.55,179.45 v152,180
  Top 1: C31.2 172.55,178.4 D31.3 172.55,179.45 v172,180 | C32.2 192.55,178.4 D32.3 192.55,179.45 v192,180 | C33.2 212.55,178.4 D33.3 212.55,179.45 v212,180 | C34.2 215.85,155 D34.3 219,151.85 v219,151 | C35.2 195.85,155 D35.3 199,151.85 v199,151 | C36.2 175.85,155 D36.3 179,151.85 v179,151 | C37.2 155.85,155 D37.3 159,151.85 v159,151 | C38.2 135.85,155 D38.3 139,151.85 v139,151 | C39.2 115.85,155 D39.3 119,151.85 v119,151 | C40.2 95.85,155 D40.3 99,151.85 v99,151 | C41.2 75.85,155 D41.3 79,151.85 v79,151 | C45.2 12.55,138.4 D45.3 12.55,139.45 v12,140 | C46.2 32.55,138.4 D46.3 32.55,139.45 v32,140 | v52,140 52.55,139.45 D47.3 52.55,138.4 C47.2 | C48.2 72.55,138.4 D48.3 72.55,139.45 v72,140 | C121.2 212.55,18.4 D121.3 212.55,19.45 v212,20 | v192,20 192.55,19.45 D120.3 192.55,18.4 C120.2 | C119.2 172.55,18.4 D119.3 172.55,19.45 v172,20 | v152,20 152.55,19.45 D118.3 152.55,18.4 C118.2 | C117.2 132.55,18.4 D117.3 132.55,19.45 v132,20 | C116.2 112.55,18.4 D116.3 112.55,19.45 v112,20 | v92,20 92.55,19.45 D115.3 92.55,18.4 C115.2 | C114.2 72.55,18.4 D114.3 72.55,19.45 v72,20 | v52,20 52.55,19.45 D113.3 52.55,18.4 C113.2 | C112.2 32.55,18.4 D112.3 32.55,19.45 v32,20 | v12,20 12.55,19.45 D111.3 12.55,18.4 C111.2 | v19,31 19,31.85 D110.3 15.85,35 C110.2 | v39,31 39,31.85 D109.3 35.85,35 C109.2 | v59,31 59,31.85 D108.3 55.85,35 C108.2 | v79,31 79,31.85 D107.3 75.85,35 C107.2 | v99,31 99,31.85 D106.3 95.85,35 C106.2 | v119,31 119,31.85 D105.3 115.85,35 C105.2 | v139,31 139,31.85 D104.3 135.85,35 C104.2 | v159,31 159,31.85 D103.3 155.85,35 C103.2 | v179,31 179,31.85 D102.3 175.85,35 C102.2 | v199,31 199,31.85 D101.3 195.85,35 C101.2
  Top 1: v219,31 219,31.85 D100.3 215.85,35 C100.2 | C99.2 212.55,58.4 D99.3 212.55,59.45 v212,60 | C98.2 192.55,58.4 D98.3 192.55,59.45 v192,60 | v172,60 172.55,59.45 D97.3 172.55,58.4 C97.2 | v152,60 152.55,59.45 D96.3 152.55,58.4 C96.2 | C95.2 132.55,58.4 D95.3 132.55,59.45 v132,60 | v112,60 112.55,59.45 D94.3 112.55,58.4 C94.2 | C93.2 92.55,58.4 D93.3 92.55,59.45 v92,60 | C92.2 72.55,58.4 D92.3 72.55,59.45 v72,60 | v52,60 52.55,59.45 D91.3 52.55,58.4 C91.2 | C90.2 32.55,58.4 D90.3 32.55,59.45 v32,60 | v12,60 12.55,59.45 D89.3 12.55,58.4 C89.2 | v19,71 19,71.85 D88.3 15.85,75 C88.2 | v39,71 39,71.85 D87.3 35.85,75 C87.2 | C86.2 55.85,75 D86.3 59,71.85 v59,71 | C85.2 75.85,75 D85.3 79,71.85 v79,71 | v119,71 119,71.85 D83.3 115.85,75 C83.2 | v139,71 139,71.85 D82.3 135.85,75 C82.2 | v159,71 159,71.85 D81.3 155.85,75 C81.2 | v99,71 99,71.85 D84.3 95.85,75 C84.2 | C80.2 175.85,75 D80.3 179,71.85 v179,71 | C79.2 195.85,75 D79.3 199,71.85 v199,71 | C78.2 215.85,75 D78.3 219,71.85 v219,71 | v219,111 219,111.85 D56.3 215.85,115 C56.2 | v199,111 199,111.85 D57.3 195.85,115 C57.2 | C58.2 175.85,115 D58.3 179,111.85 v179,111 | v159,111 159,111.85 D59.3 155.85,115 C59.2 | C60.2 135.85,115 D60.3 139,111.85 v139,111 | v119,111 119,111.85 D61.3 115.85,115 C61.2 | v99,111 99,111.85 D62.3 95.85,115 C62.2 | v79,111 79,111.85 D63.3 75.85,115 C63.2 | v19,111 19,111.85 D66.3 15.85,115 C66.2 | v39,111 39,111.85 D65.3 35.85,115 C65.2 | v59,111 59,111.85 D64.3 55.85,115 C64.2 | C67.2 12.55,98.4 D67.3 12.55,99.45 v12,100 | v32,100 32.55,99.45 D68.3 32.55,98.4 C68.2 | C69.2 52.55,98.4 D69.3 52.55,99.45 v52,100 | C70.2 72.55,98.4 D70.3 72.55,99.45 v72,100
  Top 1: C71.2 92.55,98.4 D71.3 92.55,99.45 v92,100 | v112,100 112.55,99.45 D72.3 112.55,98.4 C72.2 | C73.2 132.55,98.4 D73.3 132.55,99.45 v132,100 | C74.2 152.55,98.4 D74.3 152.55,99.45 v152,100 | C75.2 172.55,98.4 D75.3 172.55,99.45 v172,100 | v192,100 192.55,99.45 D76.3 192.55,98.4 C76.2 | v212,100 212.55,99.45 D77.3 212.55,98.4 C77.2 | C55.2 212.55,138.4 D55.3 212.55,139.45 v212,140 | C54.2 192.55,138.4 D54.3 192.55,139.45 v192,140 | v172,140 172.55,139.45 D53.3 172.55,138.4 C53.2 | C52.2 152.55,138.4 D52.3 152.55,139.45 v152,140 | v92,140 92.55,139.45 D49.3 92.55,138.4 C49.2 | C50.2 112.55,138.4 D50.3 112.55,139.45 v112,140 | v132,140 132.55,139.45 D51.3 132.55,138.4 C51.2 | P1.2 10.95,215 D1.3
  pour Bottom: 0,230 0,0 230,0 230,230
N$1
  Top 1: D1.2 29.35,216.6 D2.4
N$2
  Top 1: D2.2 49.35,216.6 D3.4
N$3
  Top 1: D3.2 69.35,216.6 D4.4
N$4
  Top 1: D4.2 89.35,216.6 D5.4
N$5
  Top 1: D5.2 109.35,216.6 D6.4
N$6
  Top 1: D6.2 129.35,216.6 D7.4
N$7
  Top 1: D7.2 149.35,216.6 D8.4
N$8
  Top 1: D8.2 169.35,216.6 D9.4
N$9
  Top 1: D9.2 189.35,216.6 D10.4
N$10
  Top 1: D10.2 209.35,216.6 D11.4
N$11
  Top 1: D12.2 212.15,193 201.05,193 D13.4
N$12
  Top 1: D13.2 180.65,193.4 D14.4
N$13
  Top 1: D14.2 160.65,193.4 D15.4
N$14
  Top 1: D15.2 140.65,193.4 D16.4
N$15
  Top 1: D16.2 120.65,193.4 D17.4
N$16
  Top 1: D17.2 100.65,193.4 D18.4
N$17
  Top 1: D18.2 80.65,193.4 D19.4
N$18
  Top 1: D19.2 60.65,193.4 D20.4
N$19
  Top 1: D20.2 52.15,193 41.05,193 D21.4
N$20
  Top 1: D21.2 32.15,193 21.05,193 D22.4
N$21
  Top 1: D24.4 29.35,176.6 D23.2
N$22
  Top 1: D24.2 49.35,176.6 D25.4
N$23
  Top 1: D25.2 69.35,176.6 D26.4
N$24
  Top 1: D26.2 89.35,176.6 D27.4
N$25
  Top 1: D27.2 109.35,176.6 D28.4
N$26
  Top 1: D28.2 129.35,176.6 D29.4
N$27
  Top 1: D29.2 149.35,176.6 D30.4
N$28
  Top 1: D30.2 169.35,176.6 D31.4
N$29
  Top 1: D31.2 189.35,176.6 D32.4
N$30
  Top 1: D32.2 209.35,176.6 D33.4
N$31
  Top 1: D34.2 200.65,153.4 D35.4
N$32
  Top 1: D35.2 180.65,153.4 D36.4
N$33
  Top 1: D36.2 160.65,153.4 D37.4
N$34
  Top 1: D37.2 140.65,153.4 D38.4
N$35
  Top 1: D38.2 120.65,153.4 D39.4
N$36
  Top 1: D39.2 100.65,153.4 D40.4
N$37
  Top 1: D40.2 80.65,153.4 D41.4
N$38
  Top 1: D41.2 60.65,153.4 D42.4
N$39
  Top 1: D42.2 40.65,153.4 D43.4
N$40
  Top 1: D43.2 20.65,153.4 D44.4
N$41
  Top 1: D46.4 29.35,136.6 D45.2
N$42
  Top 1: D47.4 49.35,136.6 D46.2
N$43
  Top 1: D48.4 69.35,136.6 D47.2
N$44
  Top 1: D49.4 89.35,136.6 D48.2
N$45
  Top 1: D50.4 109.35,136.6 D49.2
N$46
  Top 1: D51.4 129.35,136.6 D50.2
N$47
  Top 1: D52.4 149.35,136.6 D51.2
N$48
  Top 1: D53.4 169.35,136.6 D52.2
N$49
  Top 1: D54.4 189.35,136.6 D53.2
N$50
  Top 1: D55.4 209.35,136.6 D54.2
N$51
  Top 1: D57.4 200.65,113.4 D56.2
N$52
  Top 1: D58.4 180.65,113.4 D57.2
N$53
  Top 1: D59.4 160.65,113.4 D58.2
N$54
  Top 1: D60.4 140.65,113.4 D59.2
N$55
  Top 1: D61.4 120.65,113.4 D60.2
N$56
  Top 1: D62.4 100.65,113.4 D61.2
N$57
  Top 1: D63.4 80.65,113.4 D62.2
N$58
  Top 1: D64.4 60.65,113.4 D63.2
N$59
  Top 1: D65.4 40.65,113.4 D64.2
N$60
  Top 1: D66.4 20.65,113.4 D65.2
N$61
  Top 1: D68.4 29.35,96.6 D67.2
N$62
  Top 1: D69.4 49.35,96.6 D68.2
N$63
  Top 1: D70.4 69.35,96.6 D69.2
N$64
  Top 1: D71.4 89.35,96.6 D70.2
N$65
  Top 1: D72.4 109.35,96.6 D71.2
N$66
  Top 1: D73.4 129.35,96.6 D72.2
N$67
  Top 1: D74.4 149.35,96.6 D73.2
N$68
  Top 1: D75.4 169.35,96.6 D74.2
N$69
  Top 1: D76.4 189.35,96.6 D75.2
N$70
  Top 1: D77.4 209.35,96.6 D76.2
N$71
  Top 1: D79.4 200.65,73.4 D78.2
N$72
  Top 1: D80.4 180.65,73.4 D79.2
N$73
  Top 1: D81.4 160.65,73.4 D80.2
N$74
  Top 1: D82.4 140.65,73.4 D81.2
N$75
  Top 1: D83.4 120.65,73.4 D82.2
N$76
  Top 1: D84.4 100.65,73.4 D83.2
N$77
  Top 1: D85.4 80.65,73.4 D84.2
N$78
  Top 1: D86.4 60.65,73.4 D85.2
N$79
  Top 1: D87.4 40.65,73.4 D86.2
N$80
  Top 1: D88.4 20.65,73.4 D87.2
N$81
  Top 1: D89.2 29.35,56.6 D90.4
N$82
  Top 1: D90.2 49.35,56.6 D91.4
N$83
  Top 1: D91.2 69.35,56.6 D92.4
N$84
  Top 1: D92.2 89.35,56.6 D93.4
N$85
  Top 1: D93.2 109.35,56.6 D94.4
N$86
  Top 1: D94.2 129.35,56.6 D95.4
N$87
  Top 1: D95.2 149.35,56.6 D96.4
N$88
  Top 1: D96.2 169.35,56.6 D97.4
N$89
  Top 1: D97.2 189.35,56.6 D98.4
N$90
  Top 1: D98.2 209.35,56.6 D99.4
N$91
  Top 1: D100.2 200.65,33.4 D101.4
N$92
  Top 1: D101.2 180.65,33.4 D102.4
N$93
  Top 1: D102.2 160.65,33.4 D103.4
N$94
  Top 1: D103.2 140.65,33.4 D104.4
N$95
  Top 1: D104.2 120.65,33.4 D105.4
N$96
  Top 1: D105.2 100.65,33.4 D106.4
N$97
  Top 1: D106.2 80.65,33.4 D107.4
N$98
  Top 1: D107.2 60.65,33.4 D108.4
N$99
  Top 1: D108.2 40.65,33.4 D109.4
N$100
  Top 1: D109.2 20.65,33.4 D110.4
N$101
  Top 1: D111.2 29.35,16.6 D112.4
N$102
  Top 1: D112.2 49.35,16.6 D113.4
N$103
  Top 1: D113.2 69.35,16.6 D114.4
N$104
  Top 1: D114.2 89.35,16.6 D115.4
N$105
  Top 1: D115.2 109.35,16.6 D116.4
N$106
  Top 1: D116.2 129.35,16.6 D117.4
N$107
  Top 1: D117.2 149.35,16.6 D118.4
N$108
  Top 1: D118.2 169.35,16.6 D119.4
N$109
  Top 1: D119.2 189.35,16.6 D120.4
N$110
  Top 1: D120.2 209.35,16.6 D121.4
ROW1_DIN
  Top 1: P1.3 12.15,213 D1.4
ROW1_DOUT
  Top 1: D11.2 220,214.05 220,199.15 D12.4
ROW2_DOUT
  Top 1: D22.2 10,190.85 10,175.95 D23.4
ROW3_DOUT
  Top 1: D33.2 220,174.05 220,159.15 D34.4
ROW4_DOUT
  Top 1: D44.2 10,150.85 10,135.95 D45.4
ROW5_DOUT
  Top 1: D55.2 220,134.05 220,119.15 D56.4
ROW6_DOUT
  Top 1: D66.2 10,110.85 10,95.95 D67.4
ROW7_DOUT
  Top 1: D77.2 220,94.05 220,79 217.6,76.6 D78.4
ROW8_DOUT
  Top 1: D88.2 10,70.85 10,55.95 D89.4
ROW9_DOUT
  Top 1: D99.2 220,54.05 220,39 217.6,36.6 D100.4
ROW10_DOUT
  Top 1: D110.2 10,30.85 10,15.95 D111.4
VCC  (via drill 1)
  Top 1: C1.1 15.85,215 D1.1 | C2.1 35.85,215 D2.1 | C3.1 55.85,215 D3.1 | C4.1 75.85,215 D4.1 | C5.1 95.85,215 D5.1 | C6.1 115.85,215 D6.1 | D9.1 175.85,215 C9.1 | C8.1 155.85,215 D8.1 | C7.1 135.85,215 D7.1 | C16.1 132.55,198.4 D16.1 | C14.1 172.55,198.4 D14.1 | C12.1 212.55,198.4 D12.1 | C11.1 215.85,215 D11.1 | C10.1 195.85,215.15 197.45,213.55 D10.1 | C17.1 112.55,198.4 D17.1 | C18.1 92.55,198.4 D18.1 | C22.1 12.55,198.4 D22.1 | C21.1 32.55,198.4 D21.1 | C20.1 52.55,198.4 D20.1 | C19.1 72.55,198.4 D19.1 | C13.1 192.55,198.4 D13.1 | C23.1 15.85,175 D23.1 | C44.1 12.55,158.4 D44.1 | C43.1 32.55,158.4 D43.1 | C42.1 52.55,158.4 D42.1 | C24.1 35.85,175 D24.1 | C25.1 55.85,175 D25.1 | C26.1 75.85,175 D26.1 | C27.1 95.85,175 D27.1 | C28.1 115.85,175 D28.1 | C29.1 135.85,175 D29.1 | C30.1 155.85,175 D30.1 | C31.1 175.85,175 D31.1 | C32.1 195.85,175 D32.1 | C33.1 215.85,175 D33.1 | C34.1 212.55,158.4 D34.1 | C35.1 192.55,158.4 D35.1 | C36.1 172.55,158.4 D36.1 | C37.1 152.55,158.4 D37.1 | C38.1 132.55,158.4 D38.1 | C39.1 112.55,158.4 D39.1 | C40.1 92.55,158.4 D40.1 | C41.1 72.55,158.4 D41.1 | C45.1 15.85,135 D45.1 | C46.1 35.85,135 D46.1 | C47.1 55.85,135 D47.1 | C48.1 75.85,135 D48.1 | C121.1 215.85,15 D121.1 | C120.1 195.85,15 D120.1 | C119.1 175.85,15 D119.1 | C118.1 155.85,15 D118.1 | D117.1 135.85,15 C117.1 | D116.1 115.85,15 C116.1 | C115.1 95.85,15 D115.1 | C114.1 75.85,15 D114.1 | C113.1 55.85,15 D113.1 | C112.1 35.85,15 D112.1 | C111.1 15.85,15 D111.1 | C100.1 212.55,38.4 D100.1 | C101.1 192.55,38.4 D101.1 | C102.1 172.55,38.4 D102.1 | C103.1 152.55,38.4 D103.1 | C104.1 132.55,38.4 D104.1 | C105.1 112.55,38.4 D105.1 | C106.1 92.55,38.4 D106.1 | C110.1 12.55,38.4 D110.1 | C109.1 32.55,38.4 D109.1
  Top 1: C108.1 52.55,38.4 D108.1 | C107.1 72.55,38.4 D107.1 | C99.1 215.85,55 D99.1 | D98.1 195.85,55 C98.1 | C97.1 175.85,55 D97.1 | C96.1 155.85,55 D96.1 | C95.1 135.85,55 D95.1 | C94.1 115.85,55 D94.1 | C93.1 95.85,55 D93.1 | C92.1 75.85,55 D92.1 | C91.1 55.85,55 D91.1 | C90.1 35.85,55 D90.1 | C89.1 15.85,55 D89.1 | D88.1 12.55,78.4 C88.1 | D87.1 32.55,78.4 C87.1 | D86.1 52.55,78.4 C86.1 | D85.1 72.55,78.4 C85.1 | C84.1 92.55,78.4 D84.1 | C83.1 112.55,78.4 D83.1 | C82.1 132.55,78.4 D82.1 | C81.1 152.55,78.4 D81.1 | C80.1 172.55,78.4 D80.1 | C79.1 192.55,78.4 D79.1 | C78.1 212.55,78.4 D78.1 | C56.1 212.55,118.4 D56.1 | C57.1 192.55,118.4 D57.1 | C58.1 172.55,118.4 D58.1 | C59.1 152.55,118.4 D59.1 | C60.1 132.55,118.4 D60.1 | C61.1 112.55,118.4 D61.1 | C62.1 92.55,118.4 D62.1 | C65.1 32.55,118.4 D65.1 | C66.1 12.55,118.4 D66.1 | C67.1 15.85,95 D67.1 | C68.1 35.85,95 D68.1 | C64.1 52.55,118.4 D64.1 | C63.1 72.55,118.4 D63.1 | D70.1 75.85,95 C70.1 | 55.9,99.95 C69.1 55.85,95 D69.1 | D71.1 95.85,95 C71.1 | C72.1 115.85,95 D72.1 | C73.1 135.85,95 D73.1 | C74.1 155.85,95 D74.1 | C75.1 175.85,95 D75.1 | C76.1 195.85,95 D76.1 | C77.1 215.85,95 D77.1 | D55.1 215.85,135 C55.1 | D54.1 195.85,135 C54.1 | C53.1 175.85,135 D53.1 | C52.1 155.85,135 D52.1 | C49.1 95.85,135 D49.1 | C50.1 115.85,135 D50.1 | C51.1 135.85,135 D51.1
  Bottom 1: v22,180 v22,173 | v22,100 v22,93 | v22,60 v22,53 | v22,20 v22,13 | v22,140 v22,133 | v22,37 v22,30 | v42,20 v42,13 | v42,37 v42,30 | v62,37 v62,30 | v62,20 v62,13 | v82,20 v82,13 | v82,37 v82,30 | v122,37 v122,30 | v102,37 v102,30 | v102,20 v102,13 | v122,20 v122,13 | v142,37 v142,30 | v142,20 v142,13 | v162,37 v162,30 | v162,20 v162,13 | v182,37 v182,30 | v182,20 v182,13 | v202,37 v202,30 | v202,60 v202,53 | v202,20 v202,13 | v182,60 v182,53 | v162,60 v162,53 | v142,60 v142,53 | v122,60 v122,53 | v102,60 v102,53 | v42,60 v42,53 | v62,60 v62,53 | v82,60 v82,53 | v102,77 v102,70 | v22,77 v22,70 | v42,77 v42,70 | v62,77 v62,70 | v82,77 v82,70 | v122,77 v122,70 | v142,77 v142,70 | v162,77 v162,70 | v182,77 v182,70 | v202,100 v202,93 | v202,77 v202,70 | v182,100 v182,93 | v162,100 v162,93 | v142,100 v142,93 | v122,100 v122,93 | v102,100 v102,93 | v82,100 v82,93 | v62,100 v62,93 | v42,100 v42,93 | v62,117 v62,110 | v82,117 v82,110 | v102,117 v102,110 | v122,117 v122,110 | v142,117 v142,110 | v162,117 v162,110 | v182,117 v182,110 | v202,117 v202,110 | v202,140 v202,133 | v182,140 v182,133 | v162,140 v162,133 | v142,140 v142,133 | v122,140 v122,133 | v102,140 v102,133 | v82,140 v82,133 | v62,140 v62,133 | v42,140 v42,133 | v22,157 v22,150 | v42,157 v42,150 | v62,157 v62,150 | v82,157 v82,150 | v102,157 v102,150 | v122,157 v122,150 | v142,157 v142,150 | v162,157 v162,150 | v182,157 v182,150 | v202,157 v202,150 | v42,117 v42,110 | v22,117 v22,110 | v22,196 v22,189 | v42,196 v42,189 | v42,180 v42,173 | v62,180 v62,173 | v82,180 v82,173 | v102,180 v102,173 | v122,180 v122,173 | v142,180 v142,173 | v122,196 v122,189 | v142,196 v142,189 | v62,196 v62,189 | v82,196 v82,189 | v102,196 v102,189 | v162,196 v162,189 | v182,196 v182,189 | v182,219 v182,212 | v162,219 v162,212 | v142,219 v142,212
  Bottom 1: v122,219 v122,212 | v102,219 v102,212 | v82,219 v82,212 | v61,219 v61,212 | v42,219 v42,212 | v22,219 v22,212 | v202,219 v202,212 | v202,196 v202,189 | v202,180 v202,173 | v182,180 v182,173 | v162,180 v162,173
  pour Top: 0,230 230,230 230,0 0,0

### Text on the board
tStop: FRAMED WORDCLOCK V1.0 | LUKAS BLOCHER